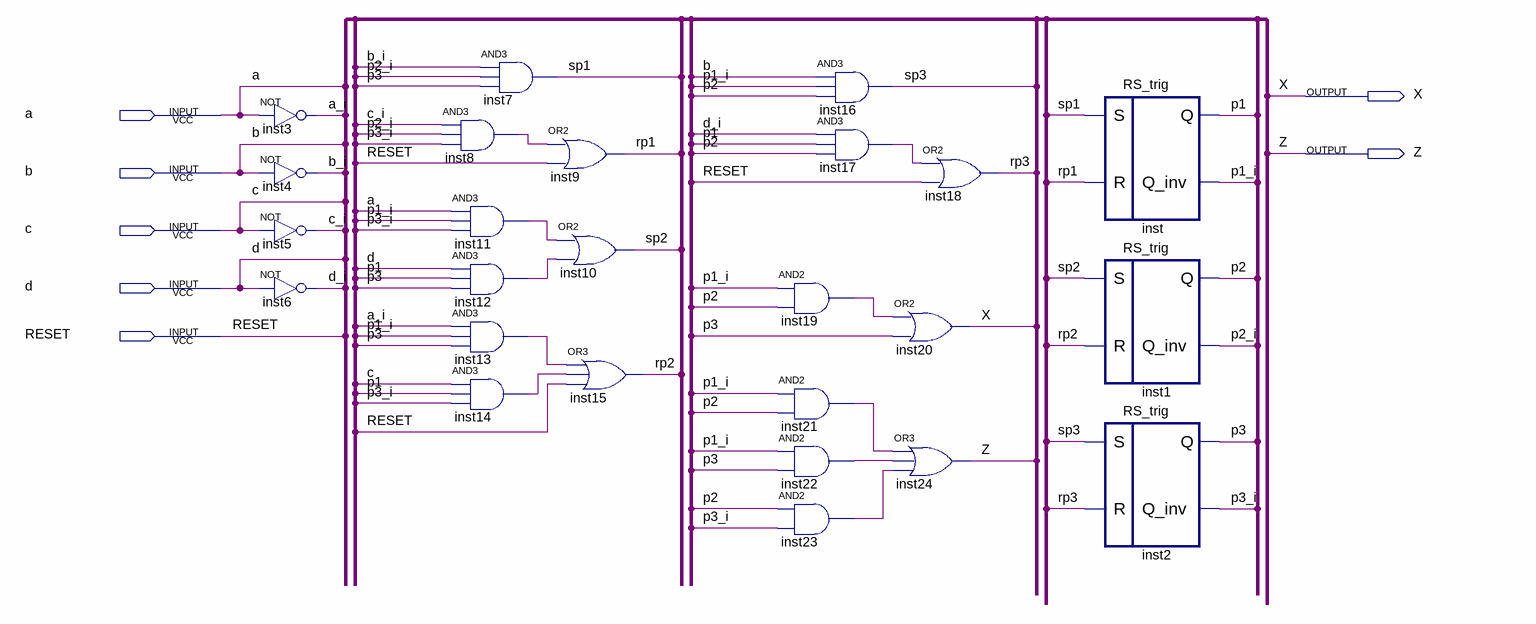
[diagram p0: schematic sheet]
// Quartus schematic lab_8_3.bdf as structural Verilog: 25 symbols, 7 pins
module lab_8_3 (
  input  a,
  input  b,
  input  c,
  input  d,
  input  RESET,
  output X,
  output Z
);

  wire a_i, b_i, c_i, d_i, inst8_out, inst11_out, inst12_out, inst13_out, inst14_out, inst17_out, inst19_out,
       inst21_out, inst22_out, inst23_out, p1, p1_i, p2, p2_i, p3, p3_i, rp1, rp2, rp3, sp1, sp2, sp3;

  not inst3 (a_i, a);
  not inst4 (b_i, b);
  not inst5 (c_i, c);
  not inst6 (d_i, d);
  and inst8 (inst8_out, c_i, p2_i, p3_i);
  and inst11 (inst11_out, a, p1_i, p3_i);
  and inst12 (inst12_out, d, p1, p3);
  and inst13 (inst13_out, a_i, p1_i, p3);
  and inst14 (inst14_out, c, p1, p3_i);
  and inst7 (sp1, b_i, p2_i, p3);
  or inst9 (rp1, inst8_out, RESET);
  or inst10 (sp2, inst11_out, inst12_out);
  or inst15 (rp2, inst13_out, inst14_out, RESET);
  and inst19 (inst19_out, p1_i, p2);
  and inst21 (inst21_out, p1_i, p2);
  and inst22 (inst22_out, p1_i, p3);
  and inst23 (inst23_out, p2, p3_i);
  and inst16 (sp3, b, p1_i, p2);
  and inst17 (inst17_out, d_i, p1, p2);
  or inst18 (rp3, inst17_out, RESET);
  or inst20 (X, inst19_out, p3);
  or inst24 (Z, inst21_out, inst22_out, inst23_out);
  RS_trig inst (.R(rp1), .S(sp1), .Q_inv(p1_i), .Q(p1));
  RS_trig inst1 (.R(rp2), .S(sp2), .Q_inv(p2_i), .Q(p2));
  RS_trig inst2 (.R(rp3), .S(sp3), .Q_inv(p3_i), .Q(p3));
endmodule
